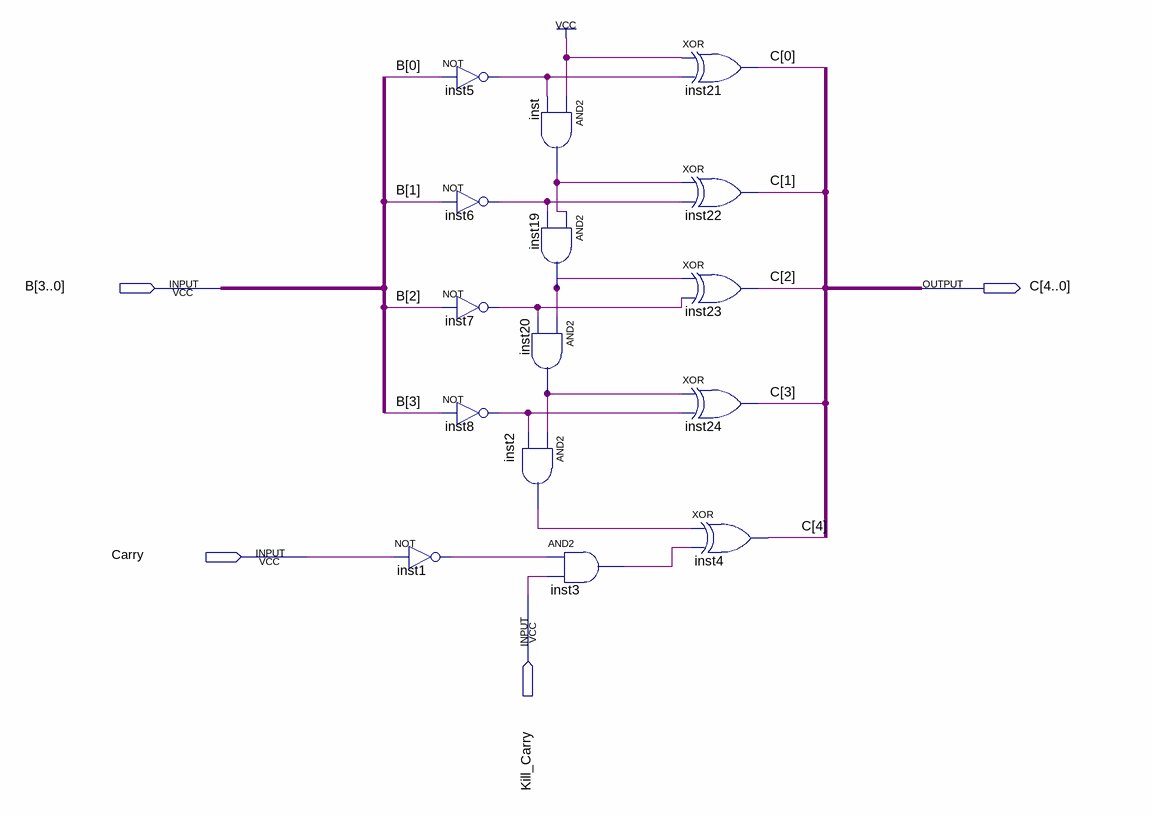
[diagram p0: schematic sheet]
// Quartus schematic ComplementoA2_5bits.bdf as structural Verilog: 15 symbols, 4 pins
module ComplementoA2_5bits (
  input  [3:0] B,
  input  Carry,
  input  Kill_Carry,
  output [4:0] C
);

  wire inst1_out, inst2_out, inst3_out, inst5_out, inst6_out, inst7_out, inst8_out, inst19_out, inst20_out,
       inst_out;

  not inst1 (inst1_out, Carry);
  not inst5 (inst5_out, B[0]);
  not inst6 (inst6_out, B[1]);
  not inst7 (inst7_out, B[2]);
  not inst8 (inst8_out, B[3]);
  and inst (inst_out, 1'b1, inst5_out);
  and inst19 (inst19_out, inst_out, inst6_out);
  and inst20 (inst20_out, inst19_out, inst7_out);
  and inst2 (inst2_out, inst20_out, inst8_out);
  and inst3 (inst3_out, inst1_out, Kill_Carry);
  xor inst21 (C[0], 1'b1, inst5_out);
  xor inst22 (C[1], inst_out, inst6_out);
  xor inst23 (C[2], inst19_out, inst7_out);
  xor inst24 (C[3], inst20_out, inst8_out);
  xor inst4 (C[4], inst2_out, inst3_out);
endmodule
